# Altium schematic sheet Opto_AQY280SX.SchDoc
size A4; SheetNumber: 10; SheetTotal: 10
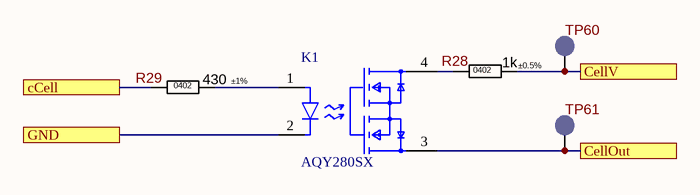
[diagram p0: Opto_AQY280SX.SchDoc]

## Parts
K1  AQY280SX  [FP-AQY280SX-MFG]
R28  Tolerance: ±0.5%  Package: 0402  [R_ANY_CHIP_0402_MED]  (hidden comment: 1k)
R29  Tolerance: ±1%  Package: 0402  [R_ANY_CHIP_0402_MED]  (hidden comment: 430)
TP60  LED_LINK  [TP_SMD_2mm]  (value not drawn)  (no BOM)
TP61  LED_LINK  [TP_SMD_2mm]  (value not drawn)  (no BOM)

## Ports
cCell (see CellVoltageControl[2D]), CellOut (see CellVoltageControl[2D]), CellV (see CellVoltageControl[2D]), GND (see CellVoltageControl[2D], DC-DC_5V0_To_3V3[2C], DC-DC_24V_To_5V0[1C], ISO_PWR_UCC12040DVER[1C], MCU_STM32L010K4T6[3B], MCU_STM32L010K4T6[4B], RS-485_SN65HVD72DRBR[1B], RS-485_SN65HVD72DRBR[1C])

## Nets
cCell: R29.1 ; port cCell
CellOut: K1.3(1_DRAIN) TP61.1 ; port CellOut
CellV: R28.2 TP60.1 ; port CellV
GND: K1.2(C) ; port GND
NetK1_1: K1.1(A) R29.2
NetK1_4: K1.4(2_DRAIN) R28.1

## Library data of the parts
K1 = CMP-00287-00695349-1: AQY280SX AQY Photomos Series 120 mA 350 V 25 Ohm SMT 1 Channel Solid State Relay -SOP-4; NexarPartId: 695349; Output Current: 120mA; Throw Configuration: DPST, SPST; Resistance: 25Ω; Max Input Current: 50mA; Max Output Voltage: 350V; Isolation Voltage: 1.5kV; Termination: Gull Wing; Number of Pins: 4; Max Output Current: 120mA; RoHS: Compliant; Mount: Surface Mount; Radiation Hardening: No; Max Operating Temperature: 85°C; Height: 2.1mm; Case/Package: SOP; Forward Current: 50mA; Input Current: 50mA; Lead Free: Lead Free; Length: 4.4mm; Width: 4.3mm; Min Operating Temperature: -40°C; Output Voltage: 350V; Relay Type: Relay; Load Current: 120mA; Part Number: AQY280SX; Supplier 1: Mouser; Supplier Part Number 1: 769-AQY280SX
R28 = RC0402DR-071KL: 1 kOhms ±0.5% 1/16W 0402 Thick Film Resistor; Manufacturer: Yageo; Power Rating: 0.062W; Voltage: 50V; Component Status: Released; Temperature Stability: ±100ppm/°C; Replacement: NONE; Value: 1k; Part Number: RC0402DR-071KL; Component Type: SMD; Part Type: Thick Film; Temperature Range: -55°C ~ 155°C; ComponentLink1URL: https://www.yageo.com/upload/media/product/productsearch/datasheet/rchip/PYu-RC_Group_51_RoHS_L_12.pdf; Supplier 1: Digi-Key; Supplier Part Number 1: 13-RC0402DR-071KLTR-ND; Price: 0.015; ComponentLink1Description: Datasheet
R29 = RC0402FR-07430RL: 430 Ohms ±1% 1/16W 0402 Thick Film Resistor; Manufacturer: Yageo; Power Rating: 0.062W; Voltage: 50V; Component Status: Released; Temperature Stability: ±100ppm/°C; Replacement: NONE; Value: 430; Part Number: RC0402FR-07430RL; Component Type: SMD; Part Type: Thick Film; Temperature Range: -55°C ~ 155°C; ComponentLink1URL: https://eu.mouser.com/datasheet/2/447/PYu_RC_Group_51_RoHS_L_11-1984063.pdf; Supplier 1: Digi-Key; Supplier Part Number 1: 311-430LRTR-ND; Price: 0.00065; ComponentLink1Description: Datasheet
TP60 TP61 = TP-PAD-SMD: Test Point SMD Pad 1.0mm/1.5mm/2mm; Replacement: NONE; Part Number: TP-PAD-SMD; Part Type: Test Point; Component Type: SMD; Temperature Range: NONE; ComponentLink1URL: NONE; ComponentLink1Description: Datasheet